# EAGLE design LB_BIT_o21_number-v03(rev5_4) (EAGLE 6.6.0)
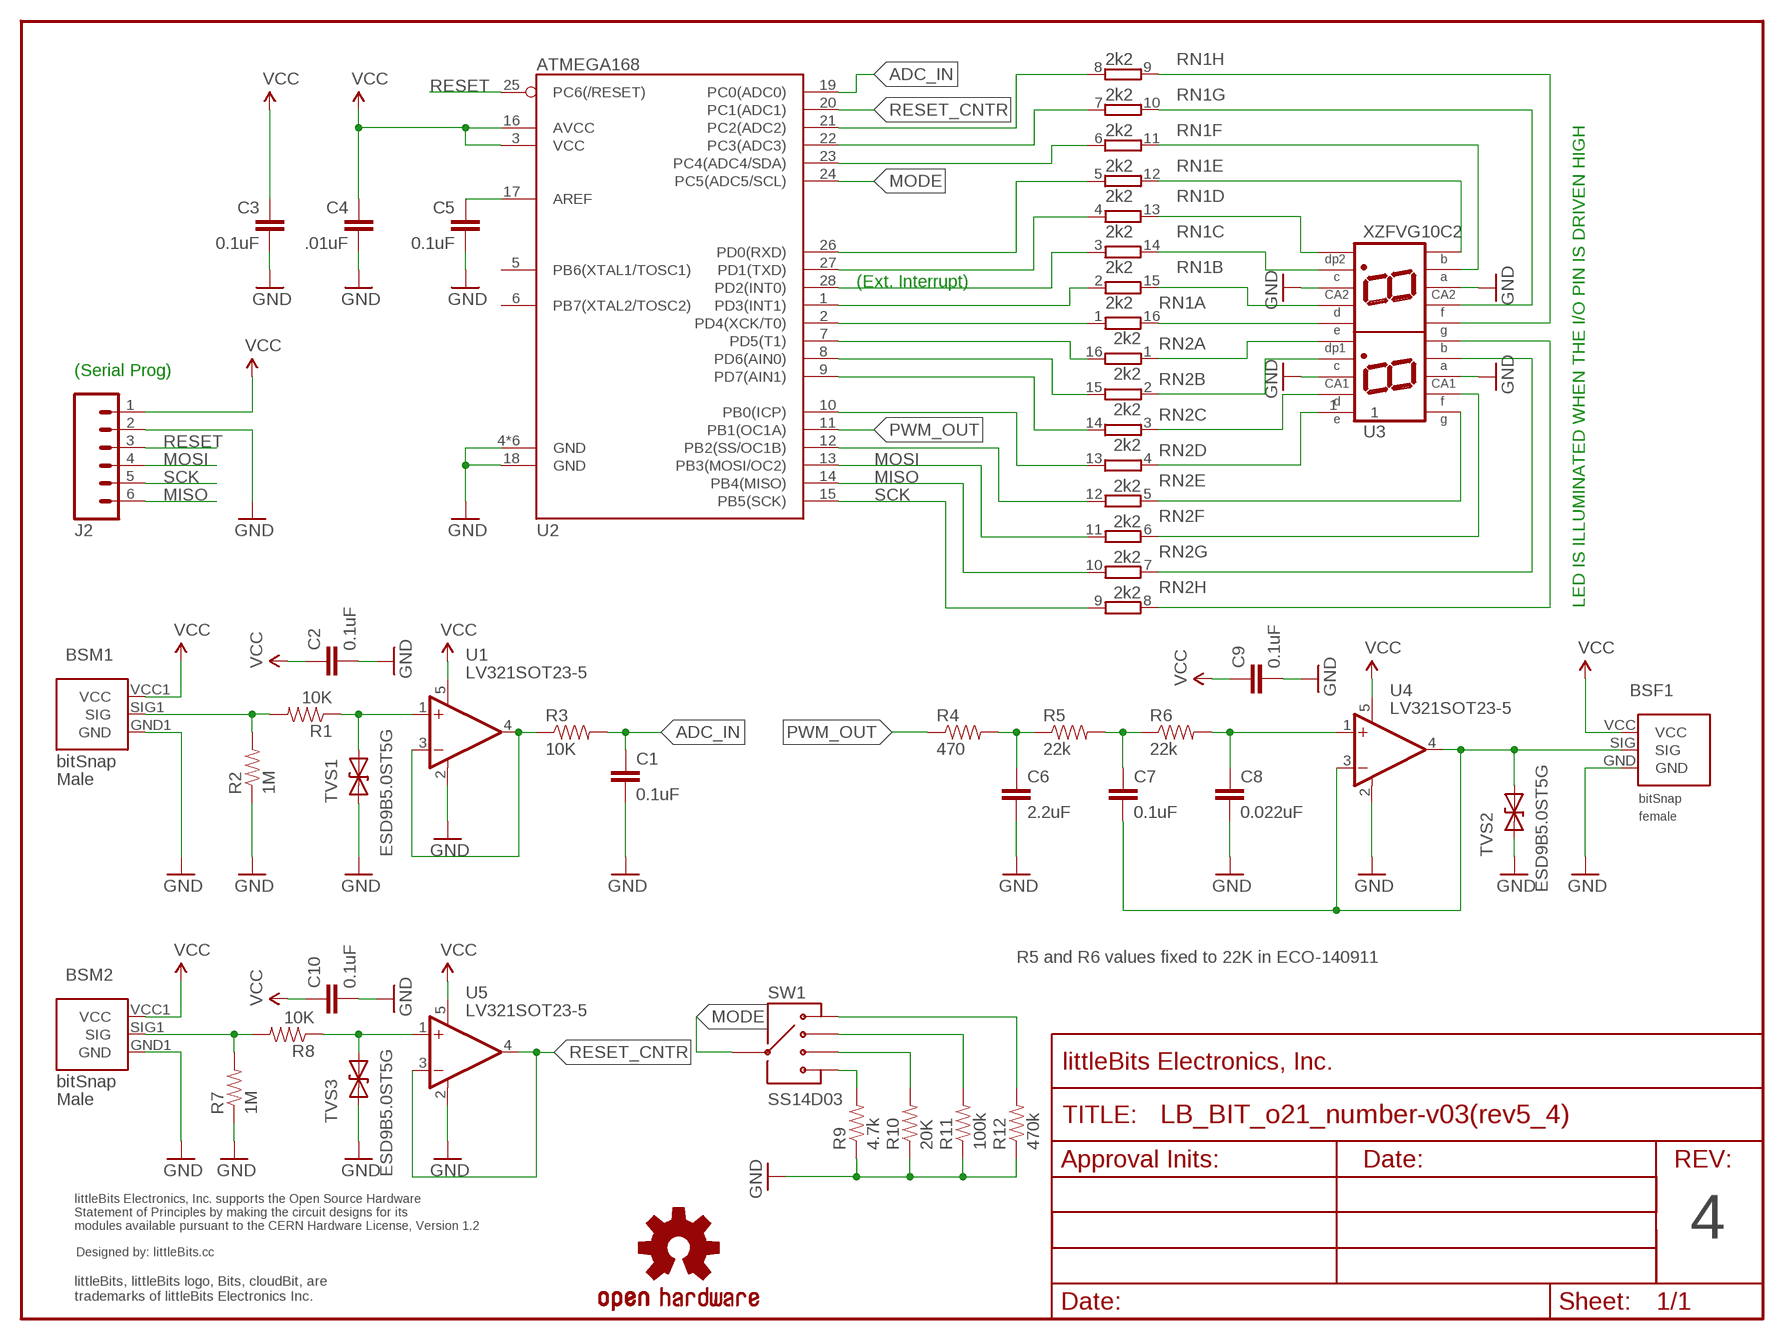
[diagram p0: schematic, sheet 1]

## Parts
BSF1  BITSNAP_V03_FEMALE  [BITSNAP_V03_FEMALE]
BSM1  BITSNAP_V03_MALE  [BITSNAP_V03_MALE]
BSM2  BITSNAP_V03_MALE  [BITSNAP_V03_MALE]
C1  0.1uF  CAPCAP-0603  [CAP-0603]
C2  0.1uF  CAPCAP-0603  [CAP-0603]
C3  0.1uF  CAPCAP-0603  [CAP-0603]
C4  .01uF  CAPCAP-0603  [CAP-0603]
C5  0.1uF  CAPCAP-0603  [CAP-0603]
C6  2.2uF  CAPCAP-0603  [CAP-0603]
C7  0.1uF  CAPCAP-0603  [CAP-0603]
C8  0.022uF  CAPCAP-0603  [CAP-0603]
C9  0.1uF  CAPCAP-0603  [CAP-0603]
C10  0.1uF  CAPCAP-0603  [CAP-0603]
J2  HRD-60.1INCH_NO_SILKSCREEN  [SIP6-SM-0.1IN-NOS.S.]
R1  10K  RESISTOR0603  [RES-0603]
R2  1M  RESISTOR0603  [RES-0603]
R3  10K  RESISTOR0603  [RES-0603]
R4  470  RESISTOR0603  [RES-0603]
R5  22k  RESISTOR0603  [RES-0603]
R6  22k  RESISTOR0603  [RES-0603]
R7  1M  RESISTOR0603  [RES-0603]
R8  10K  RESISTOR0603  [RES-0603]
R9  4.7k  RESISTOR0603  [RES-0603]
R10  20K  RESISTOR0603  [RES-0603]
R11  100k  RESISTOR0603  [RES-0603]
R12  470k  RESISTOR0603  [RES-0603]
RN1  2k2  RES_ARRAY8_DIPEXB2HV  [EXB2HV]
RN2  2k2  RES_ARRAY8_DIPEXB2HV  [EXB2HV]
SW1  SS14D03  SWITCH-SLIDE-SS14D03  [SWITCH-SLIDE-SP4T-SS14D03]
TVS1  ESD9B5.0ST5G  DIODE-TVSSOD-923  [SOD-923]
TVS2  ESD9B5.0ST5G  DIODE-TVSSOD-923  [SOD-923]
TVS3  ESD9B5.0ST5G  DIODE-TVSSOD-923  [SOD-923]
U1  LV321SOT23-5  [SOT23-5]
U2  ATMEGA168  ATMEGA168-28PINVFQFN-28  [VQFN28]
U3  XZFVG10C2  LED-DUAL7SEG10.16MMDIGITS  [LED-DUAL7SEG-SM]
U4  LV321SOT23-5  [SOT23-5]
U5  LV321SOT23-5  [SOT23-5]
U$1  FRAME-LETTER-OHWOHW  [FABDWG01-OHW]
U$2  OSHWCREDIT  [OSHWCREDIT]
U$27  OSHW-LOGOL  [OSHW-LOGO-L]

## Nets
ADC_IN: C1.1 R3.2 U2.19(PC0(ADC0))
BIT_SIG: R3.1 U1.3(-IN) U1.4(OUT)
GND: BSF1.GND BSM1.GND1(GND) BSM2.GND1(GND) C1.2 C2.2 C3.2 C4.2 C5.2 C6.2 C8.2 C9.2 C10.2 J2.2 R2.1 R7.1 R9.1 R10.1 R11.1 R12.1 TVS1.1(A) TVS2.1(A) TVS3.1(A) U1.2(V-) U2.4(GND) U2.18(GND) U2.TH(GND) U2.TH@1(GND) U2.TH@2(GND) U2.TH@3(GND) U2.TH@4(GND) U3.3 U3.8 U3.13 U3.18 U4.2(V-) U5.2(V-)
MISO: J2.6 RN2.10 U2.14(PB4(MISO))
MODE: SW1.COM U2.24(PC5(ADC5/SCL))
MOSI: J2.4 RN2.11 U2.13(PB3(MOSI/OC2))
N$1: RN1.7 U2.22(PC3(ADC3))
N$2: RN1.8 U2.21(PC2(ADC2))
N$3: RN1.6 U2.23(PC4(ADC4/SDA))
N$4: RN1.1 U2.2(PD4(XCK/T0))
N$5: RN1.2 U2.1(PD3(INT1))
N$6: RN1.3 U2.28(PD2(INT0))
N$7: RN1.4 U2.27(PD1(TXD))
N$8: RN1.5 U2.26(PD0(RXD))
N$9: RN2.16 U2.7(PD5(T1))
N$10: RN2.15 U2.8(PD6(AIN0))
N$11: RN2.14 U2.9(PD7(AIN1))
N$12: RN2.13 U2.10(PB0(ICP))
N$13: RN2.12 U2.12(PB2(SS/OC1B))
N$14: C6.1 R4.2 R5.1
N$15: C7.1 R5.2 R6.1
N$16: RN1.16 U3.6
N$17: RN1.12 U3.11
N$18: RN1.11 U3.12
N$19: RN1.10 U3.14
N$20: RN1.9 U3.15
N$21: RN1.13 U3.10
N$22: RN1.15 U3.7
N$23: RN1.14 U3.9
N$24: C8.1 R6.2 U4.1(+IN)
N$25: RN2.1 U3.5
N$26: RN2.2 U3.4
N$27: RN2.3 U3.2
N$28: RN2.4 U3.1
N$29: RN2.5 U3.20
N$30: RN2.6 U3.19
N$31: RN2.7 U3.17
N$32: RN2.8 U3.16
N$33: C5.1 U2.17(AREF)
N$34: R1.1 TVS1.2(C) U1.1(+IN)
N$35: BSF1.SIG C7.2 TVS2.2(C) U4.3(-IN) U4.4(OUT)
N$37: BSM2.SIG1(SIG) R7.2 R8.2
N$41: R12.2 SW1.1
N$42: R8.1 TVS3.2(C) U5.1(+IN)
N$43: R11.2 SW1.2
N$44: R10.2 SW1.3
N$45: R9.2 SW1.4
PWM_OUT: R4.1 U2.11(PB1(OC1A))
RESET: J2.3 U2.25(PC6(/RESET))
RESET_CNTR: U2.20(PC1(ADC1)) U5.3(-IN) U5.4(OUT)
SCK: J2.5 RN2.9 U2.15(PB5(SCK))
SIG: BSM1.SIG1(SIG) R1.2 R2.2
VCC: BSF1.VCC BSM1.VCC1(VCC) BSM2.VCC1(VCC) C2.1 C3.1 C4.1 C9.1 C10.1 J2.1 U1.5(V+) U2.3(VCC) U2.16(AVCC) U4.5(V+) U5.5(V+)
Unconnected: U2.5(PB6(XTAL1/TOSC1)) U2.6(PB7(XTAL2/TOSC2))

## Notes on the sheet
- (Ext. Interrupt)
- (Serial Prog)
- LED IS ILLUMINATED WHEN THE I/O PIN IS DRIVEN HIGH
- R5 and R6 values fixed to 22K in ECO-140911
- 4

## Library data of the parts
BSF1 = bitSnap:BITSNAP_V03_FEMALE
BSM1 BSM2 = bitSnap:BITSNAP_V03_MALE
C1-C10 = LITTLEBITS:CAP
J2 = LITTLEBITS:HRD-6
R1-R12 = LITTLEBITS:RESISTOR
RN1 RN2 = LITTLEBITS:RES_ARRAY8_DIP: DIL RESISTOR
SW1 = LITTLEBITS:SWITCH-SLIDE-SS14D03: Vimex International Corp. MPN: SS-14D03 SP4T slide switch; MFG: Vimex; MPN: SS-14D03
TVS1-TVS3 = LITTLEBITS:DIODE-TVS: Bidirectional Transient Voltage Suppression Diode: Device conducts in avalanche mode after reaching a part dependent voltage threshold. Used for limiting voltage spikes on ESD sensitive inputs and outputs.; IEC_ESD_PROT0: +/-18kV; LB_PN: ?; MPN: ESD9B5.0ST5G; V_CLAMP: ?; V_OPERATION: 5V
U1 U4 U5 = LITTLEBITS:LV321
U2 = LITTLEBITS:ATMEGA168-28PIN
U3 = LITTLEBITS:LED-DUAL7SEG
U$1 = LITTLEBITS:FRAME-LETTER-OHW
U$2 = LITTLEBITS:OSHWCREDIT
U$27 = LITTLEBITS:OSHW-LOGO: Open Source Hardware Logo This logo indicates the piece of hardware it is found on incorporates a OSHW license and/or adheres to the definition of open source hardware found here: http://freedomdefined.org/OSHW

## Board
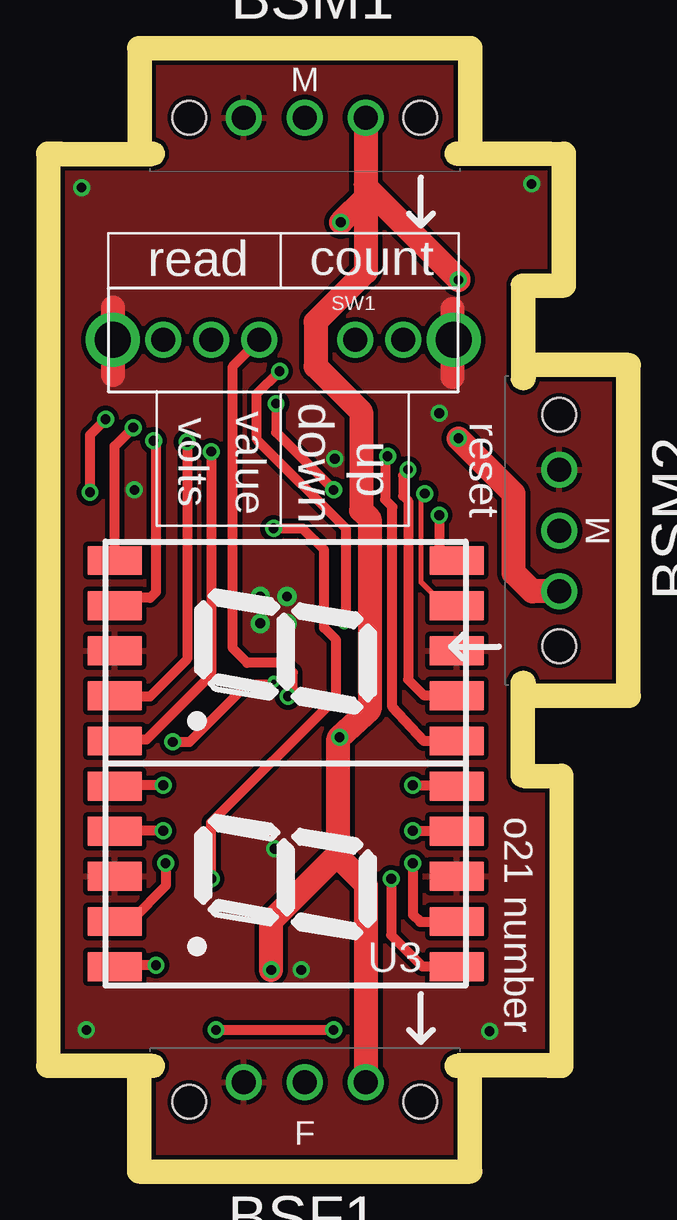
[diagram p1: board, top side]
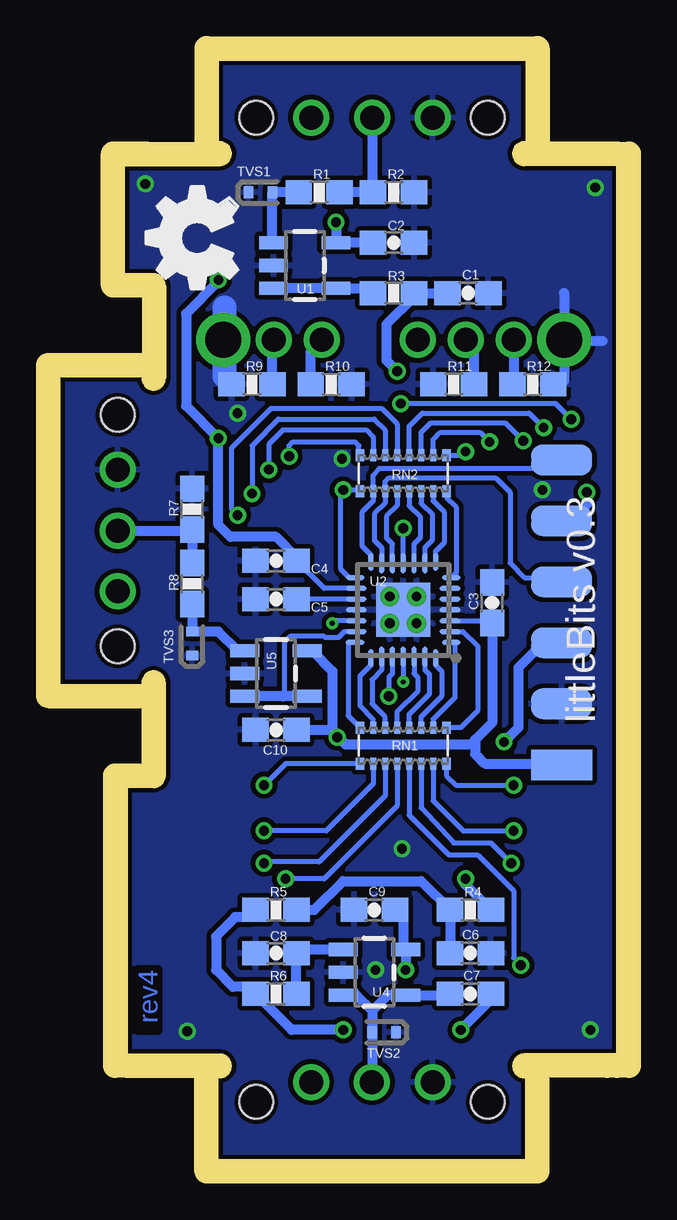
[diagram p2: board, bottom side, seen from below]

Size 23.2 x 45.81 mm. Coordinates in mm from the lower left corner, seen from the top.
Outline: 0,4.4 0,41.41
Outline: 18.8,36.41 arc-90 19.3,36.91 20.5,36.91 20.5,41.41 20.4,41.41
Outline: 20.4,4.4 20.4,15.5 19.3,15.5 arc-90 18.8,16 18.8,16.1
Copper layers (1*16): Top 0.035mm / dielectric 1.5mm / Bottom 0.035mm
Design rules "littleBitsDRC": minimum track width 0.2mm, minimum drill 0.4mm, track to track 0.2mm, track to pad 0.2mm, pad to pad 0.2mm, via to via 0.2mm, smd to smd 0mil, copper to edge 0.2mm, drill to drill 0.2mm, minimum pad ring 0.2mm, minimum via ring 0.15mm, stop-mask expansion 0.1mm, vias tented up to drill 0mil, thermal gap 0.2mm
Milling: 10 lines

### Footprints (pad centres in the part's own frame; a part is rotated, then mirrored left to right if it is on the bottom)
BITSNAP_V03_FEMALE = drill 1: GND 4.065,3.44; SIG 6.605,3.44; VCC 9.145,3.44 | hole 1.4: 1.785,2.61; 11.425,2.61
BITSNAP_V03_MALE = drill 1: GND1 9.145,2.61; SIG1 6.605,2.61; VCC1 4.065,2.61 | hole 1.4: 1.785,2.61; 11.425,2.61
CAP-0603 = smd 1.1 x 1: 1 -0.85,0; 2 0.85,0
SIP6-SM-0.1IN-NOS.S. = smd 1.27 x 2.54: 1 -6.35,0; 2 -3.81,0; 3 -1.27,0; 4 1.27,0; 5 3.81,0; 6 6.35,0
RES-0603 = smd 1.1 x 1: 1 -0.85,0; 2 0.85,0
EXB2HV = smd 0.35 x 0.5: 1 -1.8,-0.75; 8 1.8,-0.75; 9 1.8,0.75; 16 -1.8,0.75 | smd 0.25 x 0.5: 2 -1.25,-0.75; 3 -0.75,-0.75; 4 -0.25,-0.75; 5 0.25,-0.75; 6 0.75,-0.75; 7 1.25,-0.75; 10 1.25,0.75; 11 0.75,0.75; 12 0.25,0.75; 13 -0.25,0.75; 14 -0.75,0.75; 15 -1.25,0.75
SWITCH-SLIDE-SP4T-SS14D03 = drill 1: 1 2.1,0; 2 4.1,0; 3 10.1,0; 4 12.1,0; COM 6.1,0 | drill 1.5: TH$1 0,0; TH$2 14.2,0
SOD-923 = smd 0.4 x 0.5: 1 -0.5,0; 2 0.5,0
SOT23-5 = smd 0.55 x 1.2: 1 -0.95,-1.3; 2 0,-1.3; 3 0.95,-1.3; 4 0.95,1.3; 5 -0.95,1.3
VQFN28 = smd 0.75 x 0.2: 1 -2,1.35; 7 -2,-1.35; 15 2,-1.35; 21 2,1.35 | smd 0.85 x 0.2: 2 -1.95,0.9; 3 -1.95,0.455; 4 -1.95,0; 5 -1.95,-0.45; 6 -1.95,-0.9; 16 1.95,-0.9; 17 1.95,-0.45; 18 1.95,0; 19 1.95,0.45; 20 1.95,0.9 | smd 0.2 x 0.75: 8 -1.35,-2; 14 1.35,-2; 22 1.35,2; 28 -1.35,2 | smd 0.2 x 0.85: 9 -0.9,-1.95; 10 -0.45,-1.95; 11 0,-1.95; 12 0.45,-1.95; 13 0.9,-1.95; 23 0.9,1.95; 24 0.45,1.95; 25 0,1.95; 26 -0.45,1.95; 27 -0.9,1.95 | smd 2.25 x 2.25: TH 0,0 | drill 0.406 pad 0.406: TH@1 -0.559,0.559; TH@2 0.559,0.559; TH@3 -0.559,-0.559; TH@4 0.559,-0.559
LED-DUAL7SEG-SM = smd 1.2 x 2.25: 1 -8.46,-7.125; 2 -6.58,-7.125; 3 -4.7,-7.125; 4 -2.82,-7.125; 5 -0.94,-7.125; 6 0.94,-7.125; 7 2.82,-7.125; 8 4.7,-7.125; 9 6.58,-7.125; 10 8.46,-7.125; 11 8.46,7.125; 12 6.58,7.125; 13 4.7,7.125; 14 2.82,7.125; 15 0.94,7.125; 16 -0.94,7.125; 17 -2.82,7.125; 18 -4.7,7.125; 19 -6.58,7.125; 20 -8.46,7.125

### Placement (x,y rotation side)
BSF1  3.6,-0.21 0 top
BSM1  16.8,46.02 180 top
BSM2  23.41,19.6 90 top
C1  6.2,36.1 0 bottom
C2  9.3,38.2 0 bottom
C3  5.2,23.2 90 bottom
C4  14.2,24.95 180 bottom
C5  14.2,23.35 180 bottom
C6  6.1,8.6 0 bottom
C7  6.1,6.9 180 bottom
C8  14.2,8.6 180 bottom
C9  10.1,10.4 180 bottom
C10  14.2,17.9 180 bottom
DRILEGEND  [DRILEGEND]  -7.34,-26.47 0 top  (outside the outline)
J2  2.3,22.8 90 bottom
R1  12.4,40.3 0 bottom
R2  9.3,40.3 180 bottom
R3  9.3,36.1 0 bottom
R4  6.1,10.4 180 bottom
R5  14.2,10.4 180 bottom
R6  14.2,6.9 0 bottom
R7  17.7,27.1 270 bottom
R8  17.7,24 90 bottom
R9  15.2,32.3 0 bottom
R10  11.9,32.3 180 bottom
R11  6.8,32.3 0 bottom
R12  3.5,32.3 180 bottom
RN1  8.9,17.25 180 bottom
RN2  8.9,28.6 180 bottom
SW1  2.2,34.15 0 top
TVS1  14.85,40.3 0 bottom
TVS2  9.7,5.3 180 bottom
TVS3  17.7,21.5 90 bottom
U1  13,37.25 270 bottom
U2  8.9,22.9 180 bottom
U3  9.4,16.5 270 top
U4  10.1,7.8 270 bottom
U5  14.2,20.25 270 bottom
U$1  0,-0.1 0 top
U$2  -91.92,-64.05 0 top  (outside the outline)
U$20  [OSHW_FILLX150_NOTEXT]  15.8,35.45 0 top
U$27  -24.65,-71.6 0 top  (outside the outline)

### Tracks (layer width: path | path; a pad name or v marks a point on that pad's centre or on a via)
ADC_IN  (via drill 0.2, 0.41)
  Top 0.406: v11.85,22.35 11.9,22.4 11.9,26.3 8.2,30 8.2,31.9 v9.15,32.85
  Bottom 0.203: U2.19 11.7,22.45 v11.85,22.35
  Bottom 0.406: C1.1 R3.2 8.45,35.95 9.6,34.8 9.6,33.3 v9.15,32.85
BIT_SIG
  Bottom 0.406: R3.1 10.15,36.3 U1.4 U1.3
GND  (via drill 0.41)
  Top 1: 2.2,35.5 2.2,32.7 | 16.35,35.45 16.35,32.6
  Bottom 0.203: 16.35,32.65 16.35,32.6 R9.1
  Bottom 0.406: 2.2,36.1 2.2,32.45 | 0.6,34.1 3.1,34.1
  Bottom 1: 16.35,35.5 16.35,32.65
  other vias: 15.8,31.1 10.05,7.9 0.9,40.5 19.65,40.65 1.1,5.4 17.9,5.35 8.95,12.95 11.45,29.2 3.1,27.9
  pour Top: 0,-0.1 25,-0.1 25,45.9 0,45.9
  pour Top (no thermals): 7.7,24 7.7,21.8 10.1,21.8 10.1,24
  pour Bottom: 0,-0.1 25,-0.1 25,45.9 0,45.9
MISO
  Bottom 0.2: RN2.10 10.15,28.5 9.9,28.8 2.7,28.8 J2.6
  Bottom 0.203: RN2.10 10.15,27.45 10.6,27 10.6,25.55 10.25,25.2 U2.14
MODE  (via drill 0.41)
  Top 0.406: SW1.COM 7.2,33.05 7.2,21.3 7.8,20.7 9.3,20.7 9.7,20.3 9.7,19.5 v9.5,19.3
  Bottom 0.203: v9.5,19.3 9.5,20.1 9.35,20.25 U2.24
MOSI
  Bottom 0.2: RN2.11 9.65,28.25 9.5,28.4 5.05,28.4 4.45,27.8 4.45,24.85 3.85,24.25 2.48,24.25 J2.4
  Bottom 0.203: RN2.11 9.65,27.35 10.1,26.9 10.1,25.8 9.8,25.5 U2.13
N$1
  Bottom 0.203: RN1.7 10.15,18.35 10.7,18.9 10.7,20.15 10.25,20.6 U2.22
N$2
  Bottom 0.203: U2.21 11.2,21.55 11.2,18.5 RN1.8
N$3
  Bottom 0.203: RN1.6 9.65,18.45 10.2,19 10.2,20 9.8,20.4 U2.23
N$4
  Bottom 0.203: U2.2 6.4,22 5.8,21.4 5.8,18.7 6.5,18 RN1.1
N$5
  Bottom 0.2: 6.75,21.55 U2.1
  Bottom 0.203: 6.75,21.55 6.75,19.25 7.65,18.35 RN1.2
N$6
  Bottom 0.203: 7.55,20.65 U2.28 7.55,20.6 7.3,20.35 7.3,19.3 8.15,18.45 RN1.3
N$7
  Bottom 0.203: U2.27 8,20.4 7.8,20.2 7.8,19.4 8.65,18.55 RN1.4
N$8
  Bottom 0.203: RN1.5 9.15,18.65 8.3,19.5 8.3,20.1 8.45,20.25 U2.26
N$9
  Bottom 0.203: RN2.16 7.1,27.6 6.7,27.2 6.7,24.45 U2.7
N$10
  Bottom 0.203: RN2.15 7.65,27.45 7.2,27 7.2,25.7 7.55,25.35 U2.8
N$11
  Bottom 0.203: RN2.14 8.15,27.35 7.7,26.9 7.7,25.8 8,25.5 U2.9
N$12
  Bottom 0.203: RN2.13 8.65,27.25 8.2,26.8 8.2,25.9 8.45,25.65 U2.10
N$13
  Bottom 0.203: RN2.12 9.15,27.25 9.6,26.8 9.6,25.9 9.35,25.65 U2.12
N$14
  Bottom 0.406: C6.1 R4.2 8.15,11.6 11.4,11.6 12.6,10.4 R5.1
N$15  (via drill 0.41)
  Top 0.406: v6.5,5.4 v11.4,5.4
  Bottom 0.406: R5.2 15.05,10.35 15.3,10.1 15.9,10.1 16.7,9.3 16.7,7.9 16,7.2 15.4,7.2 15.1,6.9 R6.1 13.55,5.4 v11.4,5.4 | C7.1 5.25,6.65 v6.5,5.4
N$16  (via drill 0.41)
  Top 0.203: 2.31,15.6 U3.6
  Top 0.406: v4.3,15.6 2.31,15.6
  Bottom 0.203: RN1.16 7.1,16 6.7,15.6 v4.3,15.6
N$17  (via drill 0.41)
  Top 0.406: 16.46,8.1 U3.11 15.1,8.05 13.8,9.35 v13.8,11.7
  Bottom 0.203: RN1.12 9.15,14.75 12.2,11.7 v13.8,11.7
N$18  (via drill 0.41)
  Top 0.406: v14.7,12.35 14.7,10.2 15,9.9 16.5,9.9 U3.12
  Bottom 0.203: RN1.11 9.65,15.15 12.4,12.4 14.65,12.4 v14.7,12.35
N$19  (via drill 0.41)
  Top 0.406: v14.7,13.7 16.5,13.7 U3.14
  Bottom 0.203: RN1.10 10.15,15.65 12.1,13.7 v14.7,13.7
N$20  (via drill 0.41)
  Top 0.406: v14.7,15.6 16.48,15.6 U3.15
  Bottom 0.203: RN1.9 13.8,16.5 v14.7,15.6
N$21  (via drill 0.41)
  Top 0.406: v4,8.1 2.33,8.1 U3.10
  Bottom 0.203: RN1.13 8.65,14.35 7,12.7 5.8,12.7 4.3,11.2 4.3,8.4 v4,8.1
N$22  (via drill 0.41)
  Top 0.406: v4.3,13.7 2.29,13.7 U3.7
  Bottom 0.203: RN1.15 7.65,14.95 6.4,13.7 v4.3,13.7
N$23  (via drill 0.41)
  Top 0.406: 2.29,9.9 U3.9 | 2.4,10.05 U3.9 | U3.9 2.35,10 3,10 4.4,11.4 v4.4,12.35
  Bottom 0.203: RN1.14 8.15,14.65 6.8,13.2 5.25,13.2 v4.4,12.35
N$24
  Bottom 0.406: R6.2 C8.1 13.35,8.75 U4.1
N$25  (via drill 0.41)
  Top 0.406: U3.5 2.33,17.5 3.6,17.5 6.3,20.2 v6.3,29.5
  Bottom 0.203: RN2.1 6.4,29.35 v6.3,29.5
N$26  (via drill 0.41)
  Top 0.406: v5.3,29.9 5.3,20.85 3.75,19.3 2.29,19.3 U3.4
  Bottom 0.2: RN2.2 7.65,30 7.35,30.3 5.7,30.3 v5.3,29.9
N$27  (via drill 0.41)
  Top 0.406: 2.29,23.1 U3.2 2.6,23.4 3.75,23.4 4,23.65 4,29.85 v3.9,29.95
  Bottom 0.2: RN2.3 8.15,30.3 7.75,30.7 4.65,30.7 v3.9,29.95
N$28  (via drill 0.41)
  Top 0.406: U3.1 2.27,29.72 v3.05,30.5
  Bottom 0.2: RN2.4 8.65,30.55 8.1,31.1 3.65,31.1 v3.05,30.5
N$29  (via drill 0.41)
  Top 0.406: v15.8,26.85 15.8,25.1 15.95,24.95 U3.20
  Bottom 0.203: RN2.5 9.15,30.65 9.8,31.3 14.4,31.3 16.05,29.65 16.05,27.1 v15.8,26.85
N$30  (via drill 0.41)
  Top 0.203: 15.62,23.08 15.5,23.2 15.5,23.6 15.05,24.05 15.05,27.6 v15.2,27.75
  Top 0.406: U3.19 15.97,23.08 15.97,23.13 15.62,23.08
  Bottom 0.203: RN2.6 9.65,30.4 10.1,30.85 14.1,30.85 15.2,29.75 v15.2,27.75
N$31  (via drill 0.41)
  Top 0.406: v14.5,28.75 14.5,28.7 14.3,28.5 14.3,27.65 14.5,27.45 14.5,20 15.15,19.35 16.5,19.35 U3.17
  Bottom 0.203: RN2.7 10.15,30.1 10.45,30.4 13.9,30.4 14.5,29.8 v14.5,28.75
N$32  (via drill 0.41)
  Top 0.406: U3.16 15.16,17.44 13.85,18.85 13.85,27.2 13.55,27.5 13.55,29.2 v13.65,29.3
  Bottom 0.203: RN2.8 10.75,29.3 10.75,29.75 10.9,29.9 13.5,29.9 13.65,29.75 v13.65,29.3
N$33
  Bottom 0.203: U2.17 C5.1
N$34
  Bottom 0.406: R1.1 TVS1.2 14.35,38.2 U1.1
N$35
  Bottom 0.406: C7.2 7,6.85 U4.4 9.55,6.85 10.2,6.2 | 10.2,6.2 TVS2.2 BSF1.SIG | U4.3 10.85,6.85 10.2,6.2
N$37
  Bottom 0.406: 17.74,24.81 R8.2 R7.2 17.74,26.21 BSM2.SIG1
N$41
  Bottom 0.406: SW1.1 4.3,32.35 R12.2
N$42
  Bottom 0.406: R8.1 TVS3.2 16.6,22 15.8,21.2 U5.1
N$43
  Bottom 0.406: R11.2 5.95,33.8 SW1.2
N$44
  Bottom 0.406: R10.2 12.75,33.7 SW1.3
N$45
  Bottom 0.406: R9.2 14.35,34.1 SW1.4
PWM_OUT  (via drill 0.41)
  Top 0.406: v8.9,26.3 10.1,26.3 11,25.4 11,22.15 11.5,21.65 11.5,19.25 6.3,14.05 v6.3,11.7
  Bottom 0.203: U2.11 v8.9,26.3
  Bottom 0.406: v6.3,11.7 6.3,11.45 R4.1
RESET  (via drill 0.2, 0.41)
  Top 0.406: v4.7,17.4 5.4,17.4 7.8,19.8 8.8,19.8 v8.9,19.9
  Bottom 0.203: U2.25 v8.9,19.9
  Bottom 0.406: 2.3,21.5 J2.3 3.07,21.53 4.1,20.5 4.1,18 v4.7,17.4
RESET_CNTR
  Bottom 0.2: U2.20 11.25,22
  Bottom 0.203: U2.20 11.2,22 | 11.25,22 11.35,22 11.6,21.75 12.15,21.75 12.2,21.8 13.6,21.8 13.85,21.55 13.85,19.35 13.9,19.3
  Bottom 0.406: U5.4 13.9,19.3 U5.3
SCK  (via drill 0.41)
  Top 0.406: v9,31.5 9,30.3 v11.4,27.9 | v1.25,27.8 1.25,30.2 v1.9,30.85
  Bottom 0.2: v9,31.5 2.55,31.5 v1.9,30.85
  Bottom 0.203: U2.15 11.15,24.25 11.5,24.6 11.5,27.8 v11.4,27.9 10.65,27.9 RN2.9 10.75,27.8
  Bottom 0.406: 2.3,26.65 J2.5 2.16,26.75 1.8,26.75 | 1.6,26.75 1.8,26.75 | v1.25,27.8 1.25,27.3 1.8,26.75
SIG
  Bottom 0.406: R1.2 R2.2 10.2,40.35 BSM1.SIG1
VCC  (via drill 0.41)
  Top 1: BSM2.VCC1 19.68,23.67 18.9,24.45 18.9,27.75 v16.6,30.05 | BSF1.VCC 12.75,11.45 11.53,12.68 | v8.8,7.9 8.8,9.95 11.53,12.68 | 11.53,12.68 11.6,12.75 11.6,17.55 v11.65,17.6 12.9,18.75 12.9,26.7 12.55,27.05 12.55,31.15 10.65,33.05 10.65,34.9 12.74,36.99 12.74,40.54 | BSM1.VCC1 12.74,40.54 | 12.74,40.54 12.75,40.7 12.75,40.1 v11.7,39.05 | v16.6,36.65 16.6,36.68 12.74,40.54
  Bottom 0.203: U2.3 5.29,22.45 C3.1 | U2.16 12.2,23.8 C4.1
  Bottom 0.406: C2.1 U1.5 | C9.1 9.2,10.4 8.9,10.1 8.9,8.85 U4.5 8.8,8.05 v8.8,7.9 | v11.7,39.05 U1.5 | U1.5 | C3.1 5.2,18.2 5.9,17.5 5.9,17.25 | 5.9,17.25 5.9,16.9 5.5,16.5 2.35,16.5 J2.1 | C4.1 13.35,25.1 14.2,25.95 16.1,25.95 16.6,26.45 v16.6,30.05 17.95,31.4 17.95,35.25 16.65,36.55 16.6,36.55 v16.6,36.65 | 5.9,17.25 5.95,17.3 11.3,17.3 v11.65,17.6 11.65,17.65 11.85,17.85 | U5.5 12.7,21.2 11.85,20.35 11.85,17.85 | C10.1 11.9,17.9 11.85,17.85

### Text on the board
Bottom: rev4
tPlace: read | count | volts | value | down | up | reset | o21 number
bPlace: littleBits v0.3
tNames: BSM1 | BSM2 | BSF1
Milling: 1MM ROUTER PATH
Reference: XLARGE
dxf: 4 | OUTPUT BIT THAT DISPLAYS VOLTAGE ON SIGNAL LINE
DrillLegend: LAYER-STACK
DrillLegend_01-16: 01-16
DrillLegend_01-20: 01-20